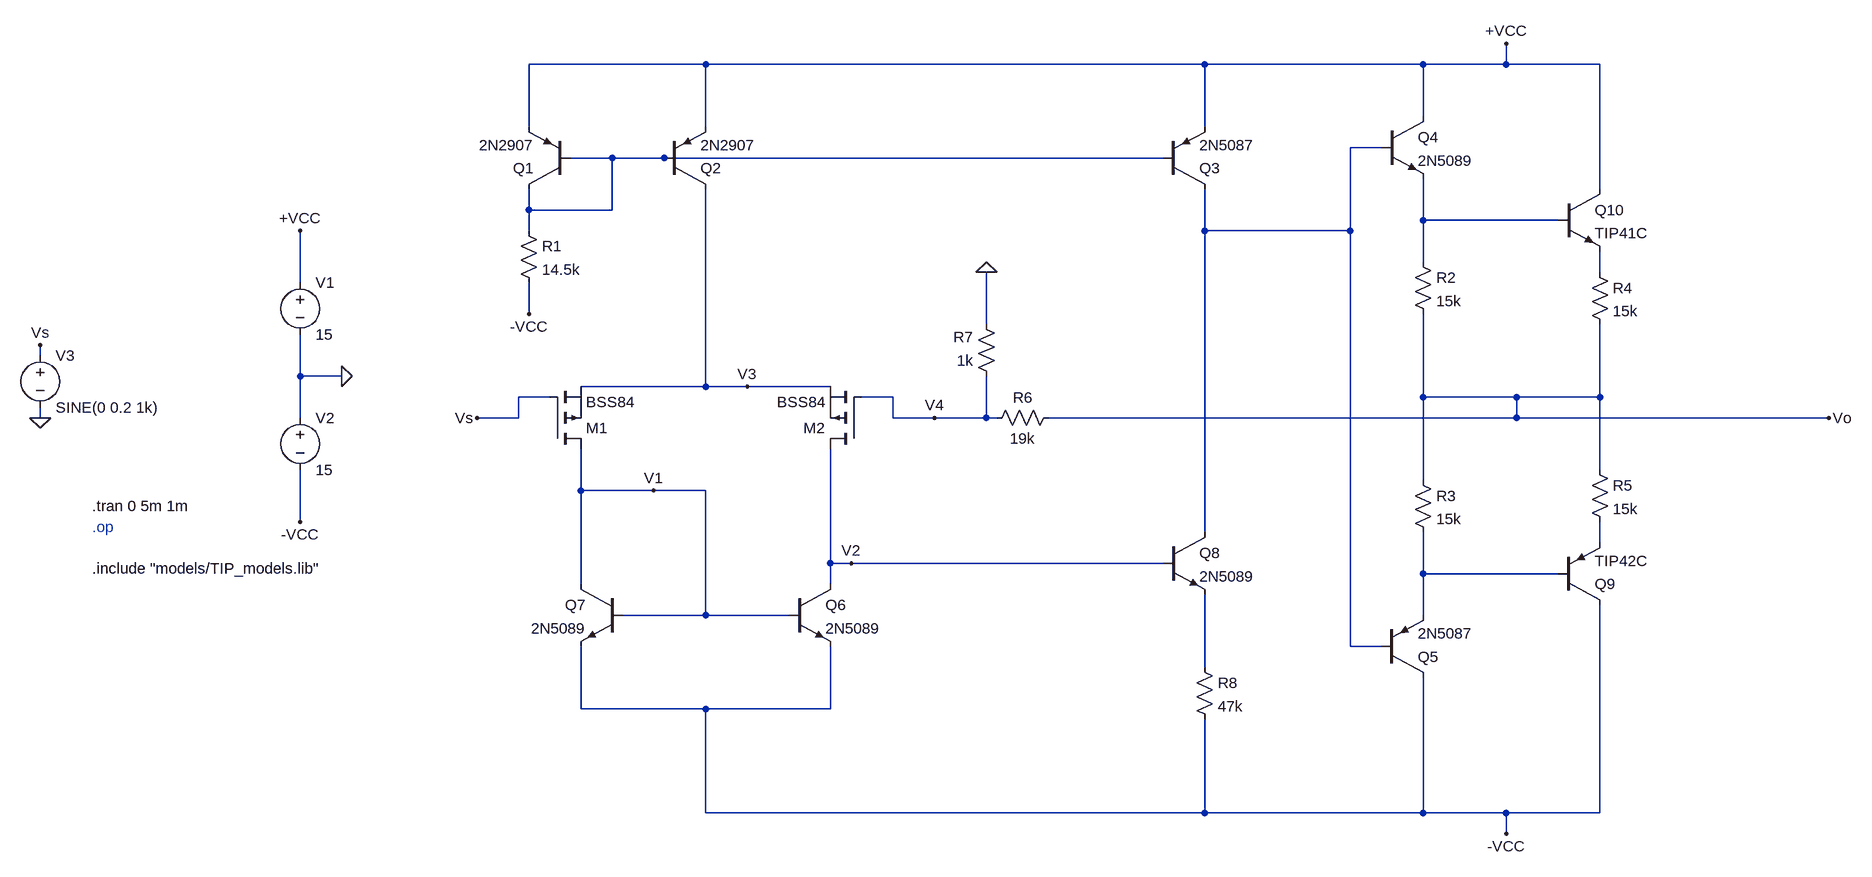
[diagram p0: schematic Draft1.asc]
Draft1.asc, the LTspice schematic file:
Version 4.1
SHEET 1 1312 836
WIRE -464 -448 -736 -448
WIRE 304 -448 -464 -448
WIRE 640 -448 304 -448
WIRE 768 -448 768 -480
WIRE 768 -448 640 -448
WIRE 912 -448 768 -448
WIRE 640 -368 640 -448
WIRE -736 -352 -736 -448
WIRE -464 -352 -464 -448
WIRE 304 -352 304 -448
WIRE 576 -320 528 -320
WIRE -608 -304 -672 -304
WIRE -528 -304 -608 -304
WIRE 240 -304 -528 -304
WIRE 912 -256 912 -448
WIRE -736 -224 -736 -256
WIRE -608 -224 -608 -304
WIRE -608 -224 -736 -224
WIRE 640 -208 640 -272
WIRE 848 -208 640 -208
WIRE -736 -192 -736 -224
WIRE 304 -192 304 -256
WIRE 528 -192 528 -320
WIRE 528 -192 304 -192
WIRE 640 -144 640 -208
WIRE 912 -128 912 -160
WIRE -1088 -112 -1088 -192
WIRE -736 -64 -736 -112
WIRE -32 -48 -32 -128
WIRE -1488 0 -1488 -16
WIRE -1088 32 -1088 -32
WIRE -1024 32 -1088 32
WIRE -464 48 -464 -256
WIRE -464 48 -656 48
WIRE -400 48 -464 48
WIRE -272 48 -400 48
WIRE -704 64 -752 64
WIRE -176 64 -224 64
WIRE 640 64 640 -64
WIRE 784 64 640 64
WIRE 912 64 912 -48
WIRE 912 64 784 64
WIRE -1488 96 -1488 80
WIRE -1088 96 -1088 32
WIRE -752 96 -752 64
WIRE -752 96 -816 96
WIRE -176 96 -176 64
WIRE -112 96 -176 96
WIRE -32 96 -32 32
WIRE -32 96 -112 96
WIRE -16 96 -32 96
WIRE 784 96 784 64
WIRE 784 96 64 96
WIRE 1264 96 784 96
WIRE 912 176 912 64
WIRE 640 192 640 64
WIRE -656 208 -656 144
WIRE -544 208 -656 208
WIRE -464 208 -544 208
WIRE -1088 256 -1088 176
WIRE 304 272 304 -192
WIRE 912 288 912 256
WIRE -272 320 -272 144
WIRE -240 320 -272 320
WIRE 240 320 -240 320
WIRE 640 336 640 272
WIRE 848 336 640 336
WIRE -656 352 -656 208
WIRE -272 352 -272 320
WIRE -464 400 -464 208
WIRE -464 400 -592 400
WIRE -336 400 -464 400
WIRE 640 400 640 336
WIRE 528 448 528 -192
WIRE 576 448 528 448
WIRE 304 480 304 368
WIRE -656 544 -656 448
WIRE -464 544 -656 544
WIRE -272 544 -272 448
WIRE -272 544 -464 544
WIRE -464 704 -464 544
WIRE 304 704 304 560
WIRE 304 704 -464 704
WIRE 640 704 640 496
WIRE 640 704 304 704
WIRE 768 704 640 704
WIRE 912 704 912 384
WIRE 912 704 768 704
WIRE 768 736 768 704
FLAG -1088 -192 +VCC
FLAG -1088 256 -VCC
FLAG -1488 -16 Vs
FLAG -1488 96 0
FLAG -1024 32 0
FLAG -736 -64 -VCC
FLAG -816 96 Vs
FLAG 768 736 -VCC
FLAG 768 -480 +VCC
FLAG 1264 96 Vo
FLAG -544 208 V1
FLAG -240 320 V2
FLAG -400 48 V3
FLAG -112 96 V4
FLAG -32 -128 0
SYMBOL voltage -1088 -128 R0
WINDOW 123 0 0 Left 0
WINDOW 39 0 0 Left 0
SYMATTR InstName V1
SYMATTR Value 15
SYMBOL voltage -1088 80 R0
WINDOW 123 0 0 Left 0
WINDOW 39 0 0 Left 0
SYMATTR InstName V2
SYMATTR Value 15
SYMBOL voltage -1488 -16 R0
WINDOW 123 0 0 Left 0
WINDOW 39 0 0 Left 0
SYMATTR InstName V3
SYMATTR Value SINE(0 0.2 1k)
SYMBOL res -752 -208 R0
SYMATTR InstName R1
SYMATTR Value 14.5k
SYMBOL pnp -672 -256 R180
SYMATTR InstName Q1
SYMATTR Value 2N2907
SYMBOL pnp -528 -256 M180
SYMATTR InstName Q2
SYMATTR Value 2N2907
SYMBOL pnp 240 -256 M180
SYMATTR InstName Q3
SYMATTR Value 2N5087
SYMBOL pmos -704 144 M180
SYMATTR InstName M1
SYMATTR Value BSS84
SYMBOL pmos -224 144 R180
SYMATTR InstName M2
SYMATTR Value BSS84
SYMBOL npn 576 -368 R0
SYMATTR InstName Q4
SYMATTR Value 2N5089
SYMBOL res 624 -160 R0
SYMATTR InstName R2
SYMATTR Value 15k
SYMBOL res 624 176 R0
SYMATTR InstName R3
SYMATTR Value 15k
SYMBOL pnp 576 496 M180
SYMATTR InstName Q5
SYMATTR Value 2N5087
SYMBOL res 896 -144 R0
SYMATTR InstName R4
SYMATTR Value 15k
SYMBOL res 896 160 R0
SYMATTR InstName R5
SYMATTR Value 15k
SYMBOL res 80 80 R90
WINDOW 0 0 56 VBottom 2
WINDOW 3 32 56 VTop 2
SYMATTR InstName R6
SYMATTR Value 19k
SYMBOL npn -336 352 R0
SYMATTR InstName Q6
SYMATTR Value 2N5089
SYMBOL npn -592 352 M0
SYMATTR InstName Q7
SYMATTR Value 2N5089
SYMBOL res -16 48 R180
WINDOW 0 36 76 Left 2
WINDOW 3 36 40 Left 2
SYMATTR InstName R7
SYMATTR Value 1k
SYMBOL npn 240 272 R0
SYMATTR InstName Q8
SYMATTR Value 2N5089
SYMBOL res 288 464 R0
SYMATTR InstName R8
SYMATTR Value 47k
SYMBOL pnp 848 384 M180
SYMATTR InstName Q9
SYMATTR Value TIP42C
SYMBOL npn 848 -256 R0
SYMATTR InstName Q10
SYMATTR Value TIP41C
TEXT -1408 232 Left 2 !.tran 0 5m 1m
TEXT -1408 264 Left 2 ;.op
TEXT -1408 328 Left 2 !.include "models/TIP_models.lib"

The netlist it stands for:
* Draft1.asc
V1 +VCC 0 15
V2 0 -VCC 15
V3 Vs 0 SINE(0 0.2 1k)
R1 N002 -VCC 14.5k
Q1 N002 N002 +VCC 0 2N2907
Q2 V3 N002 +VCC 0 2N2907
Q3 N001 N002 +VCC 0 2N5087
M1 V1 Vs V3 V3 BSS84
M2 V2 V4 V3 V3 BSS84
Q4 +VCC N001 N003 0 2N5089
R2 N003 Vo 15k
R3 Vo N006 15k
Q5 -VCC N001 N006 0 2N5087
R4 N004 Vo 15k
R5 Vo N005 15k
R6 Vo V4 19k
Q6 V2 V1 -VCC 0 2N5089
Q7 V1 V1 -VCC 0 2N5089
R7 V4 0 1k
Q8 N001 V2 N007 0 2N5089
R8 N007 -VCC 47k
Q9 -VCC N006 N005 0 TIP42C
Q10 +VCC N003 N004 0 TIP41C
.model NPN NPN
.model PNP PNP
.lib standard.bjt
.model NMOS NMOS
.model PMOS PMOS
.lib standard.mos
.tran 0 5m 1m
* .op
.include "models/TIP_models.lib"
.backanno
.end